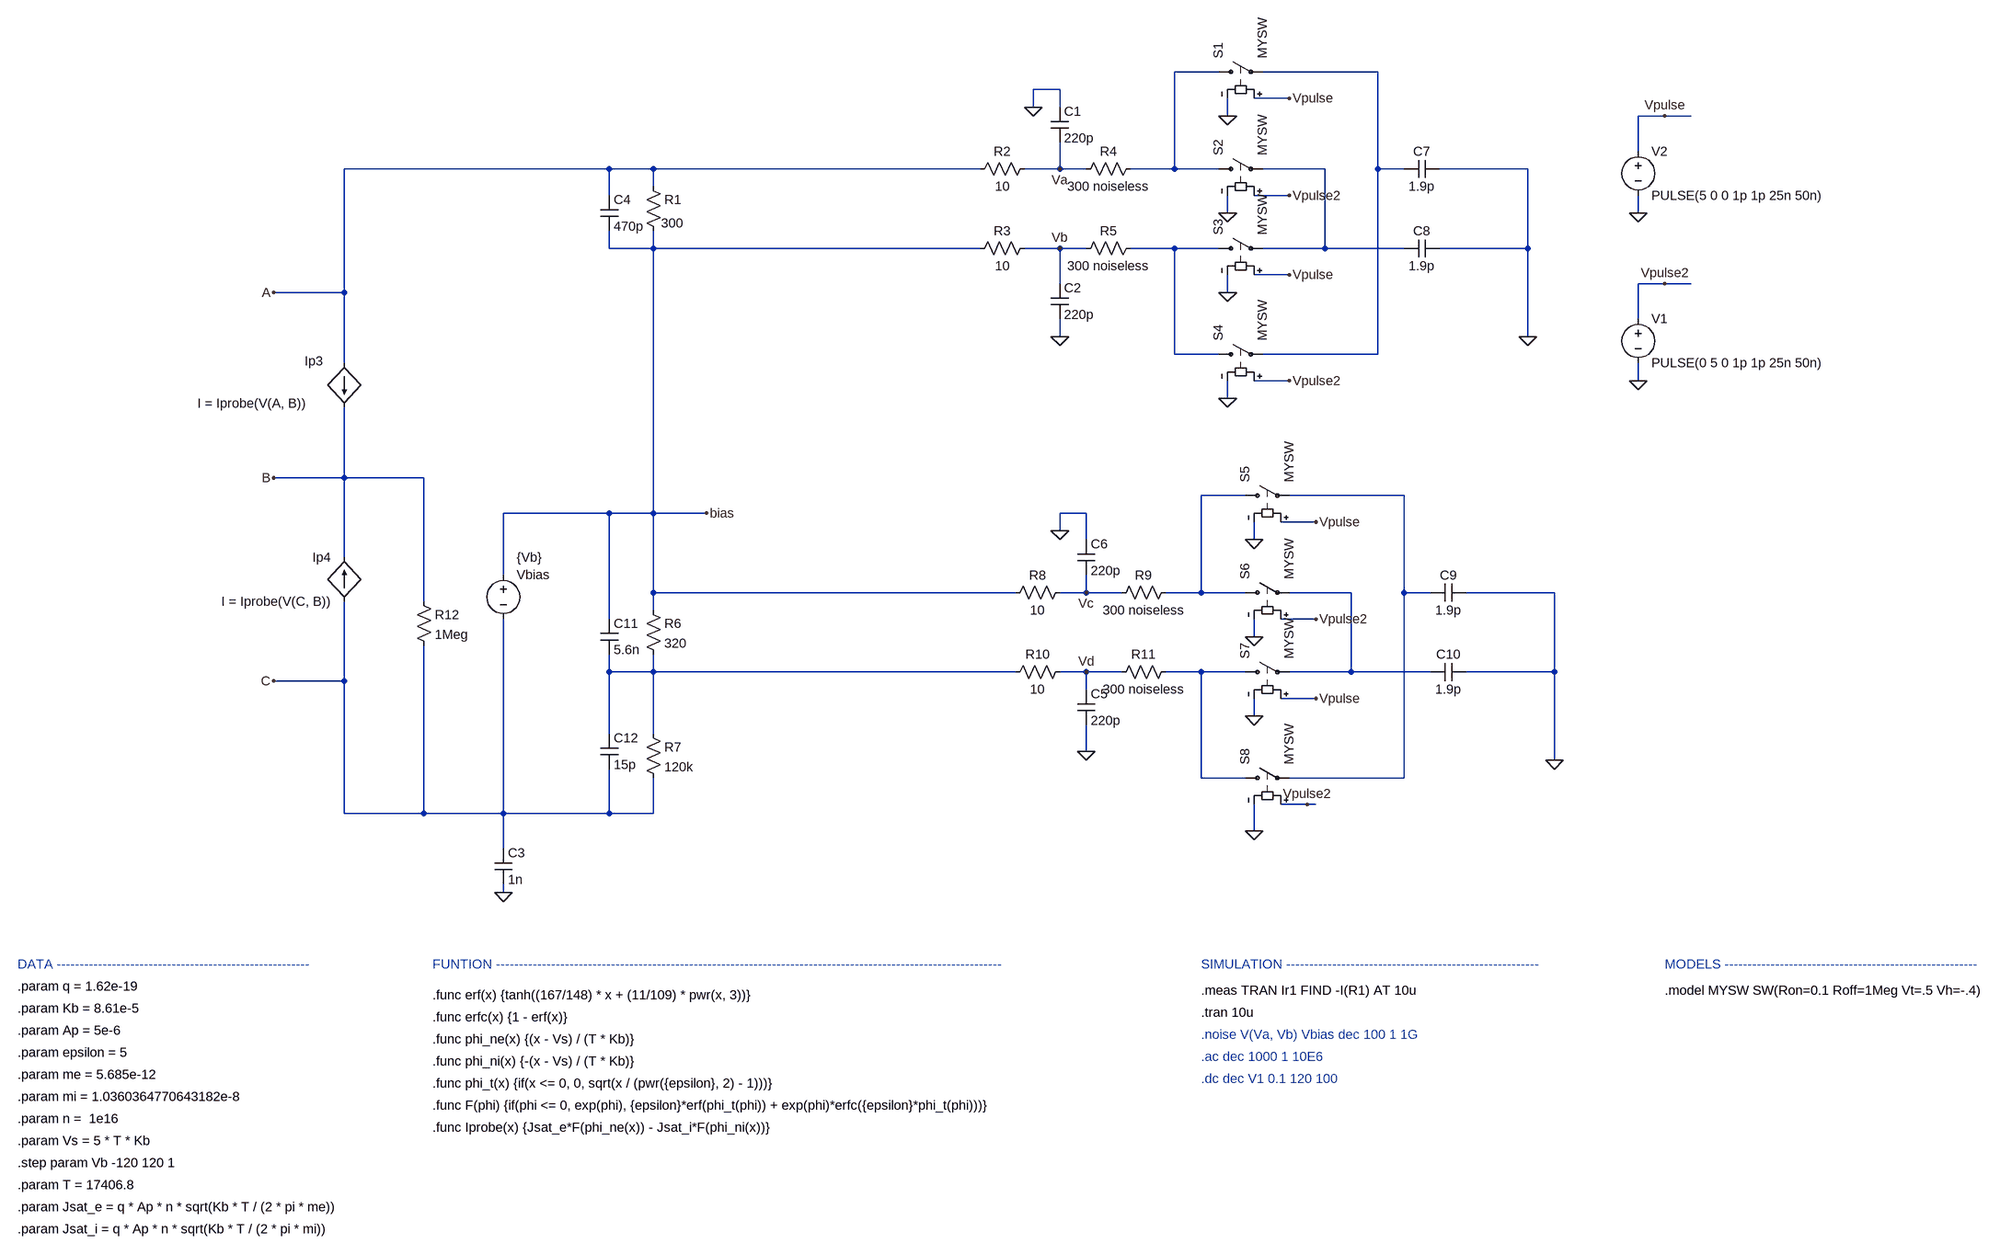
[diagram p0: schematic 4-double_probe_model.asc]
4-double_probe_model.asc, the LTspice schematic file:
Version 4.1
SHEET 1 2020 1780
WIRE 416 -3344 336 -3344
WIRE 704 -3344 496 -3344
WIRE 128 -3312 80 -3312
WIRE 544 -3296 480 -3296
WIRE 80 -3280 80 -3312
WIRE 128 -3280 128 -3312
WIRE 432 -3264 432 -3296
WIRE 1264 -3264 1216 -3264
WIRE 1312 -3264 1264 -3264
WIRE 1216 -3200 1216 -3264
WIRE -688 -3168 -1168 -3168
WIRE -608 -3168 -688 -3168
WIRE -16 -3168 -608 -3168
WIRE 128 -3168 128 -3216
WIRE 128 -3168 64 -3168
WIRE 176 -3168 128 -3168
WIRE 336 -3168 336 -3344
WIRE 336 -3168 256 -3168
WIRE 416 -3168 336 -3168
WIRE 608 -3168 496 -3168
WIRE 704 -3168 704 -3344
WIRE 752 -3168 704 -3168
WIRE 976 -3168 816 -3168
WIRE -608 -3136 -608 -3168
WIRE -688 -3120 -688 -3168
WIRE 544 -3120 480 -3120
WIRE 432 -3088 432 -3120
WIRE 1216 -3088 1216 -3120
WIRE -688 -3024 -688 -3056
WIRE -608 -3024 -608 -3056
WIRE -608 -3024 -688 -3024
WIRE -16 -3024 -608 -3024
WIRE 128 -3024 64 -3024
WIRE 176 -3024 128 -3024
WIRE 336 -3024 256 -3024
WIRE 416 -3024 336 -3024
WIRE 608 -3024 608 -3168
WIRE 608 -3024 496 -3024
WIRE 752 -3024 608 -3024
WIRE 976 -3024 976 -3168
WIRE 976 -3024 816 -3024
WIRE 544 -2976 480 -2976
WIRE 128 -2960 128 -3024
WIRE 1264 -2960 1216 -2960
WIRE 1312 -2960 1264 -2960
WIRE -1168 -2944 -1168 -3168
WIRE -1168 -2944 -1296 -2944
WIRE 432 -2944 432 -2976
WIRE 1216 -2896 1216 -2960
WIRE 128 -2864 128 -2896
WIRE 976 -2864 976 -3024
WIRE 336 -2832 336 -3024
WIRE 416 -2832 336 -2832
WIRE 704 -2832 704 -3168
WIRE 704 -2832 496 -2832
WIRE -1168 -2816 -1168 -2944
WIRE 544 -2784 480 -2784
WIRE 1216 -2784 1216 -2816
WIRE 432 -2752 432 -2784
WIRE -1168 -2608 -1168 -2736
WIRE -1168 -2608 -1296 -2608
WIRE -1024 -2608 -1168 -2608
WIRE 464 -2576 384 -2576
WIRE 752 -2576 544 -2576
WIRE -688 -2544 -880 -2544
WIRE -608 -2544 -608 -3024
WIRE -608 -2544 -688 -2544
WIRE -512 -2544 -608 -2544
WIRE 176 -2544 128 -2544
WIRE 592 -2528 528 -2528
WIRE 128 -2512 128 -2544
WIRE 176 -2496 176 -2544
WIRE 480 -2496 480 -2528
WIRE -1168 -2464 -1168 -2608
WIRE -880 -2432 -880 -2544
WIRE -608 -2400 -608 -2544
WIRE 48 -2400 -608 -2400
WIRE 176 -2400 176 -2432
WIRE 176 -2400 128 -2400
WIRE 240 -2400 176 -2400
WIRE 384 -2400 384 -2576
WIRE 384 -2400 320 -2400
WIRE 464 -2400 384 -2400
WIRE 656 -2400 544 -2400
WIRE 752 -2400 752 -2576
WIRE 800 -2400 752 -2400
WIRE 1024 -2400 864 -2400
WIRE -1024 -2384 -1024 -2608
WIRE -608 -2368 -608 -2400
WIRE -688 -2352 -688 -2544
WIRE 592 -2352 528 -2352
WIRE 480 -2320 480 -2352
WIRE -688 -2256 -688 -2288
WIRE -608 -2256 -608 -2288
WIRE -608 -2256 -688 -2256
WIRE 48 -2256 -608 -2256
WIRE 176 -2256 128 -2256
WIRE 240 -2256 176 -2256
WIRE 384 -2256 320 -2256
WIRE 464 -2256 384 -2256
WIRE 656 -2256 656 -2400
WIRE 656 -2256 544 -2256
WIRE 800 -2256 656 -2256
WIRE 1024 -2256 1024 -2400
WIRE 1024 -2256 864 -2256
WIRE -1168 -2240 -1168 -2384
WIRE -1168 -2240 -1296 -2240
WIRE 176 -2224 176 -2256
WIRE 592 -2208 528 -2208
WIRE 480 -2176 480 -2208
WIRE -688 -2144 -688 -2256
WIRE -608 -2144 -608 -2256
WIRE 176 -2112 176 -2160
WIRE 1024 -2096 1024 -2256
WIRE 384 -2064 384 -2256
WIRE 464 -2064 384 -2064
WIRE 752 -2064 752 -2400
WIRE 752 -2064 544 -2064
WIRE 576 -2016 528 -2016
WIRE 592 -2016 576 -2016
WIRE -1168 -2000 -1168 -2240
WIRE -1024 -2000 -1024 -2304
WIRE -1024 -2000 -1168 -2000
WIRE -880 -2000 -880 -2352
WIRE -880 -2000 -1024 -2000
WIRE -688 -2000 -688 -2080
WIRE -688 -2000 -880 -2000
WIRE -608 -2000 -608 -2064
WIRE -608 -2000 -688 -2000
WIRE 480 -1968 480 -2016
WIRE -880 -1936 -880 -2000
WIRE -880 -1856 -880 -1872
FLAG 128 -2864 0
FLAG 80 -3280 0
FLAG 128 -3168 Va
FLAG 128 -3024 Vb
FLAG 128 -2512 0
FLAG 176 -2112 0
FLAG 176 -2400 Vc
FLAG 176 -2256 Vd
FLAG 976 -2864 0
FLAG 544 -3296 Vpulse
FLAG 544 -2976 Vpulse
FLAG 432 -3264 0
FLAG 432 -2944 0
FLAG 1024 -2096 0
FLAG 592 -2528 Vpulse
FLAG 592 -2208 Vpulse
FLAG 480 -2496 0
FLAG 480 -2176 0
FLAG 480 -2320 0
FLAG 480 -1968 0
FLAG 432 -3088 0
FLAG 432 -2752 0
FLAG 576 -2016 Vpulse2
FLAG 592 -2352 Vpulse2
FLAG 544 -3120 Vpulse2
FLAG 544 -2784 Vpulse2
FLAG 1216 -3088 0
FLAG 1216 -2784 0
FLAG 1264 -3264 Vpulse
FLAG 1264 -2960 Vpulse2
FLAG -512 -2544 bias
FLAG -880 -1856 0
FLAG -1296 -2240 C
FLAG -1296 -2608 B
FLAG -1296 -2944 A
SYMBOL res 80 -3184 R90
WINDOW 0 0 56 VBottom 2
WINDOW 3 32 56 VTop 2
SYMATTR InstName R2
SYMATTR Value 10
SYMBOL res -32 -3008 R270
WINDOW 0 32 56 VTop 2
WINDOW 3 0 56 VBottom 2
SYMATTR InstName R3
SYMATTR Value 10
SYMBOL res 160 -3152 R270
WINDOW 0 32 56 VTop 2
WINDOW 3 0 56 VBottom 2
SYMATTR InstName R4
SYMATTR Value 300 noiseless
SYMBOL res 160 -3008 R270
WINDOW 0 32 56 VTop 2
WINDOW 3 0 56 VBottom 2
SYMATTR InstName R5
SYMATTR Value 300 noiseless
SYMBOL cap 112 -3280 R0
SYMATTR InstName C1
SYMATTR Value 220p
SYMBOL cap 112 -2960 R0
SYMATTR InstName C2
SYMATTR Value 220p
SYMBOL res 144 -2416 R90
WINDOW 0 0 56 VBottom 2
WINDOW 3 32 56 VTop 2
SYMATTR InstName R8
SYMATTR Value 10
SYMBOL res 336 -2416 R90
WINDOW 0 0 56 VBottom 2
WINDOW 3 32 56 VTop 2
SYMATTR InstName R9
SYMATTR Value 300 noiseless
SYMBOL res 144 -2272 R90
WINDOW 0 0 56 VBottom 2
WINDOW 3 32 56 VTop 2
SYMATTR InstName R10
SYMATTR Value 10
SYMBOL res 336 -2272 R90
WINDOW 0 0 56 VBottom 2
WINDOW 3 32 56 VTop 2
SYMATTR InstName R11
SYMATTR Value 300 noiseless
SYMBOL cap 160 -2224 R0
SYMATTR InstName C5
SYMATTR Value 220p
SYMBOL cap 160 -2496 R0
SYMATTR InstName C6
SYMATTR Value 220p
SYMBOL sw 400 -3344 R270
SYMATTR InstName S1
SYMATTR Value MYSW
SYMBOL sw 400 -3168 R270
SYMATTR InstName S2
SYMATTR Value MYSW
SYMBOL sw 400 -3024 R270
SYMATTR InstName S3
SYMATTR Value MYSW
SYMBOL sw 400 -2832 R270
SYMATTR InstName S4
SYMATTR Value MYSW
SYMBOL voltage 1216 -2912 R0
WINDOW 123 0 0 Left 0
WINDOW 39 0 0 Left 0
SYMATTR InstName V1
SYMATTR Value PULSE(0 5 0 1p 1p 25n 50n)
SYMBOL cap 816 -3184 R90
WINDOW 0 0 32 VBottom 2
WINDOW 3 32 32 VTop 2
SYMATTR InstName C7
SYMATTR Value 1.9p
SYMBOL cap 816 -3040 R90
WINDOW 0 0 32 VBottom 2
WINDOW 3 32 32 VTop 2
SYMATTR InstName C8
SYMATTR Value 1.9p
SYMBOL sw 448 -2576 R270
SYMATTR InstName S5
SYMATTR Value MYSW
SYMBOL sw 448 -2400 R270
SYMATTR InstName S6
SYMATTR Value MYSW
SYMBOL sw 448 -2256 R270
SYMATTR InstName S7
SYMATTR Value MYSW
SYMBOL sw 448 -2064 R270
SYMATTR InstName S8
SYMATTR Value MYSW
SYMBOL cap 864 -2416 R90
WINDOW 0 0 32 VBottom 2
WINDOW 3 32 32 VTop 2
SYMATTR InstName C9
SYMATTR Value 1.9p
SYMBOL cap 864 -2272 R90
WINDOW 0 0 32 VBottom 2
WINDOW 3 32 32 VTop 2
SYMATTR InstName C10
SYMATTR Value 1.9p
SYMBOL voltage 1216 -3216 R0
WINDOW 123 0 0 Left 0
WINDOW 39 0 0 Left 0
SYMATTR InstName V2
SYMATTR Value PULSE(5 0 0 1p 1p 25n 50n)
SYMBOL res -624 -3152 R0
WINDOW 3 30 82 Left 2
SYMATTR Value 300
SYMATTR InstName R1
SYMBOL res -624 -2384 R0
SYMATTR InstName R6
SYMATTR Value 320
SYMBOL res -624 -2160 R0
SYMATTR InstName R7
SYMATTR Value 120k
SYMBOL cap -896 -1936 R0
SYMATTR InstName C3
SYMATTR Value 1n
SYMBOL voltage -880 -2448 R0
WINDOW 3 24 -16 Left 2
WINDOW 123 0 0 Left 0
WINDOW 39 0 0 Left 0
SYMATTR Value {Vb}
SYMATTR InstName Vbias
SYMBOL cap -704 -3120 R0
SYMATTR InstName C4
SYMATTR Value 470p
SYMBOL cap -704 -2352 R0
SYMATTR InstName C11
SYMATTR Value 5.6n
SYMBOL cap -704 -2144 R0
SYMATTR InstName C12
SYMATTR Value 15p
SYMBOL bi -1168 -2816 R0
WINDOW 0 -72 -4 Left 2
WINDOW 3 -266 73 Left 2
SYMATTR InstName Ip3
SYMATTR Value I = Iprobe(V(A, B))
SYMBOL bi -1168 -2384 R180
WINDOW 0 24 80 Left 2
WINDOW 3 24 0 Left 2
SYMATTR InstName Ip4
SYMATTR Value I = Iprobe(V(C, B))
SYMBOL res -1040 -2400 R0
SYMATTR InstName R12
SYMATTR Value 1Meg
TEXT 384 -1352 Left 2 ;.ac dec 1000 1 10E6
TEXT 384 -1312 Left 2 ;.dc dec V1 0.1 120 100
TEXT 1264 -1472 Left 2 !.model MYSW SW(Ron=0.1 Roff=1Meg Vt=.5 Vh=-.4)
TEXT 384 -1392 Left 2 ;.noise V(Va, Vb) Vbias dec 100 1 1G
TEXT 384 -1432 Left 2 !.tran 10u
TEXT 384 -1472 Left 2 !.meas TRAN Ir1 FIND -I(R1) AT 10u
TEXT -1008 -1264 Left 2 !.func F(phi) {if(phi <= 0, exp(phi), {epsilon}*erf(phi_t(phi)) + exp(phi)*erfc({epsilon}*phi_t(phi)))}
TEXT -1008 -1464 Left 2 !.func erf(x) {tanh((167/148) * x + (11/109) * pwr(x, 3))}
TEXT -1008 -1520 Left 2 ;FUNTION --------------------------------------------------------------------------------------------------------------
TEXT 384 -1520 Left 2 ;SIMULATION -------------------------------------------------------
TEXT -1008 -1424 Left 2 !.func erfc(x) {1 - erf(x)}
TEXT -1008 -1304 Left 2 !.func phi_t(x) {if(x <= 0, 0, sqrt(x / (pwr({epsilon}, 2) - 1)))}
TEXT 1264 -1520 Left 2 ;MODELS -------------------------------------------------------
TEXT -1760 -1120 Left 2 !.param T = 17406.8
TEXT -1760 -1200 Left 2 !.param Vs = 5 * T * Kb
TEXT -1760 -1400 Left 2 !.param Ap = 5e-6
TEXT -1760 -1360 Left 2 !.param epsilon = 5
TEXT -1760 -1320 Left 2 !.param me = 5.685e-12
TEXT -1760 -1280 Left 2 !.param mi = 1.0360364770643182e-8
TEXT -1760 -1240 Left 2 !.param n =  1e16
TEXT -1760 -1080 Left 2 !.param Jsat_e = q * Ap * n * sqrt(Kb * T / (2 * pi * me))
TEXT -1760 -1040 Left 2 !.param Jsat_i = q * Ap * n * sqrt(Kb * T / (2 * pi * mi))
TEXT -1760 -1520 Left 2 ;DATA -------------------------------------------------------
TEXT -1008 -1384 Left 2 !.func phi_ne(x) {(x - Vs) / (T * Kb)}
TEXT -1760 -1480 Left 2 !.param q = 1.62e-19
TEXT -1008 -1344 Left 2 !.func phi_ni(x) {-(x - Vs) / (T * Kb)}
TEXT -1760 -1440 Left 2 !.param Kb = 8.61e-5
TEXT -1008 -1224 Left 2 !.func Iprobe(x) {Jsat_e*F(phi_ne(x)) - Jsat_i*F(phi_ni(x))}
TEXT -1760 -1160 Left 2 !.step param Vb -120 120 1

The netlist it stands for:
* 4-double_probe_model.asc
R2 Va A 10
R3 bias Vb 10
R4 Va N001 300 noiseless
R5 Vb N004 300 noiseless
C1 0 Va 220p
C2 Vb 0 220p
R8 Vc bias 10
R9 N005 Vc 300 noiseless
R10 Vd N008 10
R11 N009 Vd 300 noiseless
C5 Vd 0 220p
C6 0 Vc 220p
S1 N001 N002 Vpulse 0 MYSW
S2 N001 N003 Vpulse2 0 MYSW
S3 N004 N003 Vpulse 0 MYSW
S4 N004 N002 Vpulse2 0 MYSW
V1 Vpulse2 0 PULSE(0 5 0 1p 1p 25n 50n)
C7 0 N002 1.9p
C8 0 N003 1.9p
S5 N005 N006 Vpulse 0 MYSW
S6 N005 N007 Vpulse2 0 MYSW
S7 N009 N007 Vpulse 0 MYSW
S8 N009 N006 Vpulse2 0 MYSW
C9 0 N006 1.9p
C10 0 N007 1.9p
V2 Vpulse 0 PULSE(5 0 0 1p 1p 25n 50n)
R1 A bias 300
R6 bias N008 320
R7 N008 C 120k
C3 C 0 1n
Vbias bias C {Vb}
C4 A bias 470p
C11 bias N008 5.6n
C12 N008 C 15p
B§Ip3 A B I = Iprobe(V(A, B))
B§Ip4 C B I = Iprobe(V(C, B))
R12 B C 1Meg
* .ac dec 1000 1 10E6
* .dc dec V1 0.1 120 100
.model MYSW SW(Ron=0.1 Roff=1Meg Vt=.5 Vh=-.4)
* .noise V(Va, Vb) Vbias dec 100 1 1G
.tran 10u
.meas TRAN Ir1 FIND -I(R1) AT 10u
.func F(phi) {if(phi <= 0, exp(phi), {epsilon}*erf(phi_t(phi)) + exp(phi)*erfc({epsilon}*phi_t(phi)))}
.func erf(x) {tanh((167/148) * x + (11/109) * pwr(x, 3))}
* FUNTION --------------------------------------------------------------------------------------------------------------
* SIMULATION -------------------------------------------------------
.func erfc(x) {1 - erf(x)}
.func phi_t(x) {if(x <= 0, 0, sqrt(x / (pwr({epsilon}, 2) - 1)))}
* MODELS -------------------------------------------------------
.param T = 17406.8
.param Vs = 5 * T * Kb
.param Ap = 5e-6
.param epsilon = 5
.param me = 5.685e-12
.param mi = 1.0360364770643182e-8
.param n =  1e16
.param Jsat_e = q * Ap * n * sqrt(Kb * T / (2 * pi * me))
.param Jsat_i = q * Ap * n * sqrt(Kb * T / (2 * pi * mi))
* DATA -------------------------------------------------------
.func phi_ne(x) {(x - Vs) / (T * Kb)}
.param q = 1.62e-19
.func phi_ni(x) {-(x - Vs) / (T * Kb)}
.param Kb = 8.61e-5
.func Iprobe(x) {Jsat_e*F(phi_ne(x)) - Jsat_i*F(phi_ni(x))}
.step param Vb -120 120 1
.backanno
.end